# Altium project KitHocTapArduino_V2.PrjPcb
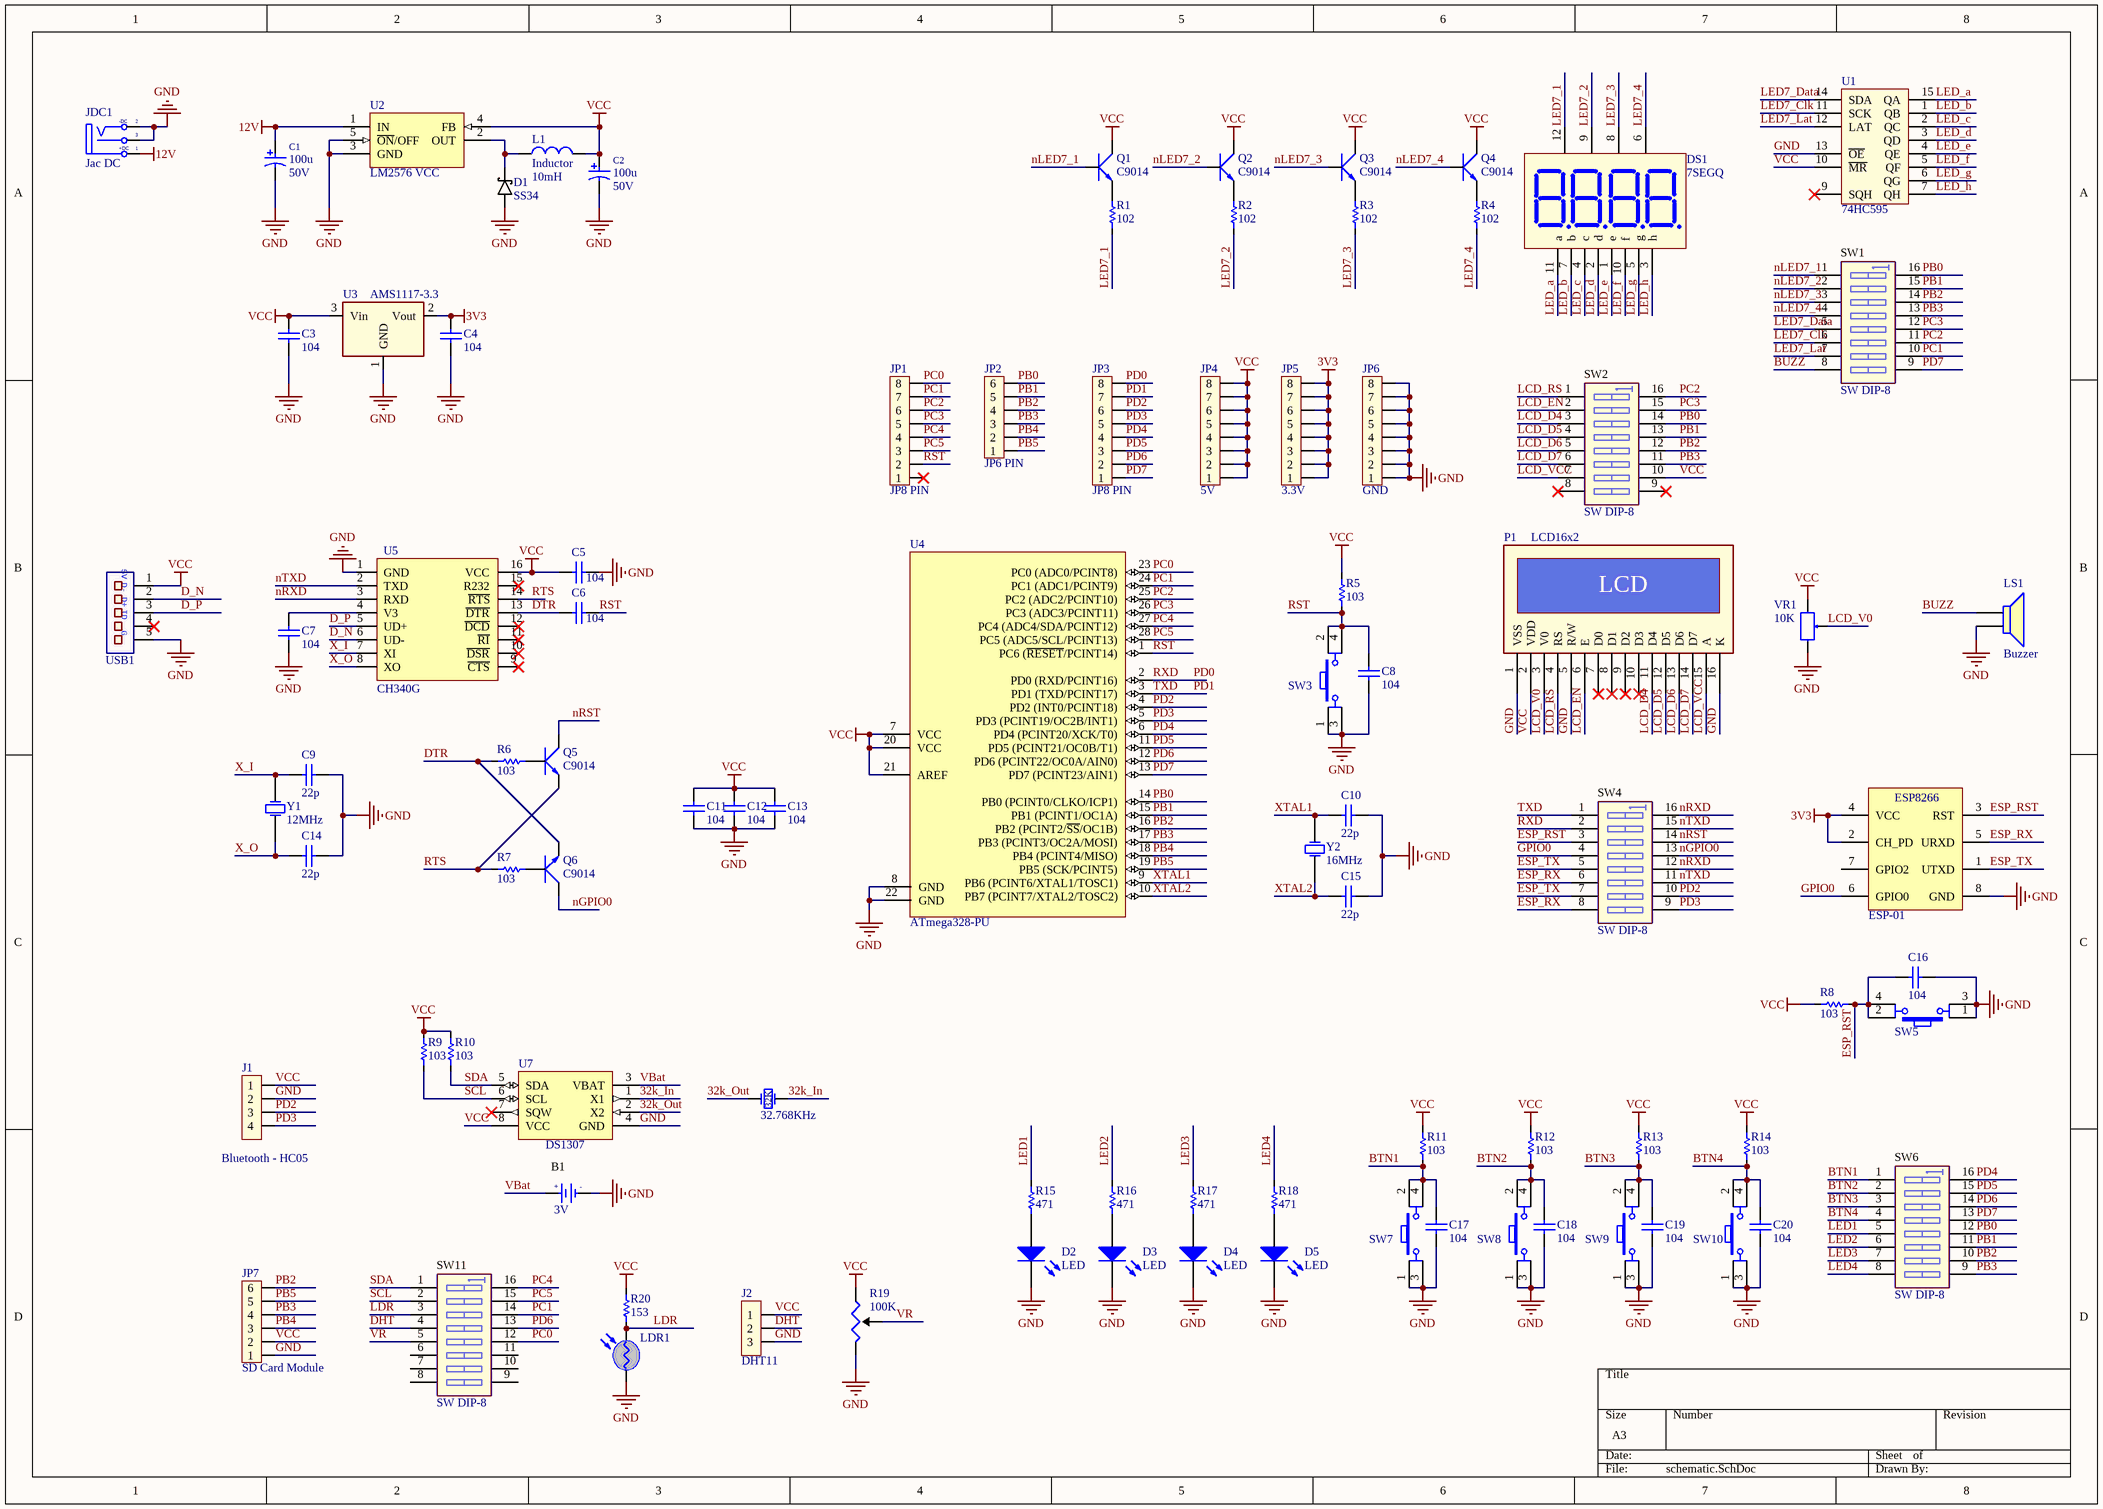
[diagram p0: schematic.SchDoc]
1 sheet, 90 parts. Net scope: global (net labels, ports and power ports of the same name join across sheets).
Board file: PCB3.PcbDoc

## Sheet schematic.SchDoc
size A3

### Parts
B1  value 3V  [CR1220]  (hidden comment: BATT-Holder)
C1  Volt: 50V  [CAP_SMD_6_3MM_N]  (hidden comment: 100u)
C2  Volt: 50V  [CAP_SMD_6_3MM_N]  (hidden comment: 100u)
C3  value 104  [CAP_SMD_0805]  (hidden comment: Cap Non-pol)
C4  value 104  [CAP_SMD_0805]  (hidden comment: Cap Non-pol)
C5  value 104  [CAP_SMD_0805]  (hidden comment: Cap Non-pol)
C6  value 104  [CAP_SMD_0805]  (hidden comment: Cap Non-pol)
C7  value 104  [CAP_SMD_0805]  (hidden comment: Cap Non-pol)
C8  value 104  [CAP_SMD_0805]  (hidden comment: Cap Non-pol)
C9  value 22p  [CAP_SMD_0805]  (hidden comment: Cap Non-pol)
C10  value 22p  [CAP_SMD_0805]  (hidden comment: Cap Non-pol)
C11  value 104  [CAP_SMD_0805]  (hidden comment: Cap Non-pol)
C12  value 104  [CAP_SMD_0805]  (hidden comment: Cap Non-pol)
C13  value 104  [CAP_SMD_0805]  (hidden comment: Cap Non-pol)
C14  value 22p  [CAP_SMD_0805]  (hidden comment: Cap Non-pol)
C15  value 22p  [CAP_SMD_0805]  (hidden comment: Cap Non-pol)
C16  value 104  [CAP_SMD_0805]  (hidden comment: Cap Non-pol)
C17  value 104  [CAP_SMD_0805]  (hidden comment: Cap Non-pol)
C18  value 104  [CAP_SMD_0805]  (hidden comment: Cap Non-pol)
C19  value 104  [CAP_SMD_0805]  (hidden comment: Cap Non-pol)
C20  value 104  [CAP_SMD_0805]  (hidden comment: Cap Non-pol)
D1  SS34  [DO-214AC,SMA]
D2  LED  [LED-0 5mm RED]
D3  LED  [LED-0 5mm RED]
D4  LED  [LED-0 5mm RED]
D5  LED  [LED-0 5mm RED]
DS1  7SEGQ  [LED7SEG-4-0.36]
J1  Bluetooth - HC05  [JP4-D1C]
J2  DHT11  [JP3]
JDC1  Jac DC  [DC-IN]
JP1  JP8 PIN  [JP8]
JP2  JP6 PIN  [JP6]
JP3  JP8 PIN  [JP8]
JP4  5V  [JP8]
JP5  3.3V  [JP8]
JP6  GND  [JP8]
JP7  SD Card Module  [JP6H]
L1  Inductor  value 10mH  [CDRH104]
LDR1  LDR  [CDS]  (value not drawn)
LS1  Buzzer  [Buzzer]
P1  LCD16x2  [LCD16x2]
Q1  C9014  [SOT23C]
Q2  C9014  [SOT23C]
Q3  C9014  [SOT23C]
Q4  C9014  [SOT23C]
Q5  C9014  [SOT23C]
Q6  C9014  [SOT23C]
R1  value 102  [RES_SMD_0805]  (hidden comment: RESISTOR)
R2  value 102  [RES_SMD_0805]  (hidden comment: RESISTOR)
R3  value 102  [RES_SMD_0805]  (hidden comment: RESISTOR)
R4  value 102  [RES_SMD_0805]  (hidden comment: RESISTOR)
R5  value 103  [RES_SMD_0805]  (hidden comment: RESISTOR)
R6  value 103  [RES_SMD_0805]  (hidden comment: RESISTOR)
R7  value 103  [RES_SMD_0805]  (hidden comment: RESISTOR)
R8  value 103  [RES_SMD_0805]  (hidden comment: RESISTOR)
R9  value 103  [RES_SMD_0805]  (hidden comment: RESISTOR)
R10  value 103  [RES_SMD_0805]  (hidden comment: RESISTOR)
R11  value 103  [RES_SMD_0805]  (hidden comment: RESISTOR)
R12  value 103  [RES_SMD_0805]  (hidden comment: RESISTOR)
R13  value 103  [RES_SMD_0805]  (hidden comment: RESISTOR)
R14  value 103  [RES_SMD_0805]  (hidden comment: RESISTOR)
R15  value 471  [RES_SMD_0805]  (hidden comment: RESISTOR)
R16  value 471  [RES_SMD_0805]  (hidden comment: RESISTOR)
R17  value 471  [RES_SMD_0805]  (hidden comment: RESISTOR)
R18  value 471  [RES_SMD_0805]  (hidden comment: RESISTOR)
R19  value 100K  [POT - 24mm]  (hidden comment: Trimmer)
R20  value 153  [RES_SMD_0805]  (hidden comment: RESISTOR)
SW1  SW DIP-8  [DIPSW8]
SW2  SW DIP-8  [DIPSW8]
SW3  SW  [SW4]  (value not drawn)
SW4  SW DIP-8  [DIPSW8]
SW5  SW  [SW4]  (value not drawn)
SW6  SW DIP-8  [DIPSW8]
SW7  SW  [SW4]  (value not drawn)
SW8  SW  [SW4]  (value not drawn)
SW9  SW  [SW4]  (value not drawn)
SW10  SW  [SW4]  (value not drawn)
SW11  SW DIP-8  [DIPSW8]
U1  74HC595  [SO-16]
U2  LM2576 VCC  [LM2576_SMD]
U3  AMS1117-3.3  [SOT223]
U4  ATmega328-PU  [DIP28/W0.3]
U5  CH340G  [SO-16]  (value not drawn)
U6  ESP-01  [ESP8266]
U7  DS1307  [SOP8]
USB1  USB-5  [USB-M3]  (value not drawn)
VR1  10K  [VR]
Y1  12MHz  [XTAL]
Y2  16MHz  [XTAL]
Y3  32.768KHz  [XT32k]

### Nets
3V3: C4.2 JP5.1 JP5.2 JP5.3 JP5.4 JP5.5 JP5.6 JP5.7 JP5.8 U3.2(Vout) U6.2(CH_PD) U6.4(VCC)
12V: C1.1 JDC1.1(T) U2.1(IN)
GND: B1.2(-) C1.2 C2.2 C3.1 C4.1 C5.1 C7.1 C8.1 C9.2 C10.2 C11.1 C12.1 C13.1 C14.2 C15.2 C16.1 C17.1 C18.1 C19.1 C20.1 D1.1(A) D2.2(K) D3.2(K) D4.2(K) D5.2(K) J1.2 J2.3 JDC1.2(TN) JDC1.3(S) JP6.1 JP6.2 JP6.3 JP6.4 JP6.5 JP6.6 JP6.7 JP6.8 JP7.1 LDR1.1(A) LS1.2 P1.1(VSS) P1.5(R/W) P1.16(K) R19.1 SW3.1 SW3.3 SW5.1 SW5.3 SW7.1 SW7.3 SW8.1 SW8.3 SW9.1 SW9.3 SW10.1 SW10.3 U1.8(GND) U1.13(~{OE}) U2.3(GND) U2.5(~{ON}/OFF) U3.1(GND) U4.8(GND) U4.22(GND) U5.1(GND) U6.8(GND) U7.4(GND) USB1.5(P5) VR1.3 Y3.0
VCC: C2.1 C3.2 C5.2 C11.2 C12.2 C13.2 J1.1 J2.1 JP4.1 JP4.2 JP4.3 JP4.4 JP4.5 JP4.6 JP4.7 JP4.8 JP7.2 L1.2 P1.2(VDD) Q1.3(C) Q2.3(C) Q3.3(C) Q4.3(C) R5.2 R8.2 R9.2 R10.2 R11.2 R12.2 R13.2 R14.2 R19.3 R20.2 SW2.10(B7) U1.10(~{MR}) U1.16(VCC) U2.4(FB) U3.3(Vin) U4.7(VCC) U4.20(VCC) U4.21(AREF) U5.16(VCC) U7.8(VCC) USB1.1(P1) VR1.1
32k_In: U7.1(X1) Y3.2(OSC2)
32k_Out: U7.2(X2) Y3.1(OSC1)
BTN1: C17.2 R11.1 SW6.1(A1) SW7.2 SW7.4
BTN2: C18.2 R12.1 SW6.2(A2) SW8.2 SW8.4
BTN3: C19.2 R13.1 SW6.3(A3) SW9.2 SW9.4
BTN4: C20.2 R14.1 SW6.4(A4) SW10.2 SW10.4
BUZZ: LS1.1 SW1.8(A8)
D_N: U5.6(UD-) USB1.2(P2)
D_P: U5.5(UD+) USB1.3(P3)
DHT: J2.2 SW11.4(A4)
DTR: C6.1 Q6.1(E) R6.2 U5.13(~{DTR})
ESP_RST: C16.2 R8.1 SW4.3(A3) SW5.2 SW5.4 U6.3(RST)
ESP_RX: SW4.6(A6) SW4.8(A8) U6.5(URXD)
ESP_TX: SW4.5(A5) SW4.7(A7) U6.1(UTXD)
GPIO0: SW4.4(A4) U6.6(GPIO0)
LCD_D4: P1.11(D4) SW2.3(A3)
LCD_D5: P1.12(D5) SW2.4(A4)
LCD_D6: P1.13(D6) SW2.5(A5)
LCD_D7: P1.14(D7) SW2.6(A6)
LCD_EN: P1.6(E) SW2.2(A2)
LCD_RS: P1.4(RS) SW2.1(A1)
LCD_V0: P1.3(V0) VR1.2
LCD_VCC: P1.15(A) SW2.7(A7)
LDR: LDR1.2(K) R20.1 SW11.3(A3)
LED1: R15.2 SW6.5(A5)
LED2: R16.2 SW6.6(A6)
LED3: R17.2 SW6.7(A7)
LED4: R18.2 SW6.8(A8)
LED7_1: DS1.12(V1) R1.1
LED7_2: DS1.9(V2) R2.1
LED7_3: DS1.8(V3) R3.1
LED7_4: DS1.6(V4) R4.1
LED7_Clk: SW1.6(A6) U1.11(SCK)
LED7_Data: SW1.5(A5) U1.14(SDA)
LED7_Lat: SW1.7(A7) U1.12(LAT)
LED_a: DS1.11(a) U1.15(QA)
LED_b: DS1.7(b) U1.1(QB)
LED_c: DS1.4(c) U1.2(QC)
LED_d: DS1.2(d) U1.3(QD)
LED_e: DS1.1(e) U1.4(QE)
LED_f: DS1.10(f) U1.5(QF)
LED_g: DS1.5(g) U1.6(QG)
LED_h: DS1.3(h) U1.7(QH)
nGPIO0: Q6.3(C) SW4.13(B4)
nLED7_1: Q1.2(B) SW1.1(A1)
nLED7_2: Q2.2(B) SW1.2(A2)
nLED7_3: Q3.2(B) SW1.3(A3)
nLED7_4: Q4.2(B) SW1.4(A4)
nRST: Q5.3(C) SW4.14(B3)
nRXD: SW4.12(B5) SW4.16(B1) U5.3(RXD)
nTXD: SW4.11(B6) SW4.15(B2) U5.2(TXD)
PB0: JP2.6 SW1.16(B1) SW2.14(B3) SW6.12(B5) U4.14(PB0_(PCINT0/CLKO/ICP1))
PB1: JP2.5 SW1.15(B2) SW2.13(B4) SW6.11(B6) U4.15(PB1_(PCINT1/OC1A))
PB2: JP2.4 JP7.6 SW1.14(B3) SW2.12(B5) SW6.10(B7) U4.16(PB2_(PCINT2/~{SS}/OC1B))
PB3: JP2.3 JP7.4 SW1.13(B4) SW2.11(B6) SW6.9(B8) U4.17(PB3_(PCINT3/OC2A/MOSI))
PB4: JP2.2 JP7.3 U4.18(PB4_(PCINT4/MISO))
PB5: JP2.1 JP7.5 U4.19(PB5_(SCK/PCINT5))
PC0: JP1.8 SW11.12(B5) U4.23(PC0_(ADC0/PCINT8))
PC1: JP1.7 SW1.10(B7) SW11.14(B3) U4.24(PC1_(ADC1/PCINT9))
PC2: JP1.6 SW1.11(B6) SW2.16(B1) U4.25(PC2_(ADC2/PCINT10))
PC3: JP1.5 SW1.12(B5) SW2.15(B2) U4.26(PC3_(ADC3/PCINT11))
PC4: JP1.4 SW11.16(B1) U4.27(PC4_(ADC4/SDA/PCINT12))
PC5: JP1.3 SW11.15(B2) U4.28(PC5_(ADC5/SCL/PCINT13))
PD0: JP3.8 SW4.2(A2) U4.2(PD0_(RXD/PCINT16))  [also labelled RXD]
PD1: JP3.7 SW4.1(A1) U4.3(PD1_(TXD/PCINT17))  [also labelled TXD]
PD2: J1.3 JP3.6 SW4.10(B7) U4.4(PD2_(INT0/PCINT18))
PD3: J1.4 JP3.5 SW4.9(B8) U4.5(PD3_(PCINT19/OC2B/INT1))
PD4: JP3.4 SW6.16(B1) U4.6(PD4_(PCINT20/XCK/T0))
PD5: JP3.3 SW6.15(B2) U4.11(PD5_(PCINT21/OC0B/T1))
PD6: JP3.2 SW6.14(B3) SW11.13(B4) U4.12(PD6_(PCINT22/OC0A/AIN0))
PD7: JP3.1 SW1.9(B8) SW6.13(B4) U4.13(PD7_(PCINT23/AIN1))
RST: C6.2 C8.2 JP1.2 R5.1 SW3.2 SW3.4 U4.1(PC6_(~{RESET}/PCINT14))
RTS: Q5.1(E) R7.2 U5.14(~{RTS})
SCL: R9.1 SW11.2(A2) U7.6(SCL)
SDA: R10.1 SW11.1(A1) U7.5(SDA)
VBat: B1.1(+) U7.3(VBAT)
VR: R19.2 SW11.5(A5)
X_I: C9.1 U5.7(XI) Y1.2(OSC2)
X_O: C14.1 U5.8(XO) Y1.1(OSC1)
XTAL1: C10.1 U4.9(PB6_(PCINT6/XTAL1/TOSC1)) Y2.2(OSC2)
XTAL2: C15.1 U4.10(PB7_(PCINT7/XTAL2/TOSC2)) Y2.1(OSC1)
NetC7_2: C7.2 U5.4(V3)
NetD1_2: D1.2(K) L1.1 U2.2(OUT)
NetD2_1: D2.1(A) R15.1
NetD3_1: D3.1(A) R16.1
NetD4_1: D4.1(A) R17.1
NetD5_1: D5.1(A) R18.1
NetQ1_1: Q1.1(E) R1.2
NetQ2_1: Q2.1(E) R2.2
NetQ3_1: Q3.1(E) R3.2
NetQ4_1: Q4.1(E) R4.2
NetQ5_2: Q5.2(B) R6.1
NetQ6_2: Q6.2(B) R7.1

Not connected (* = marked no-connect by the designer): JP1 1*; P1 7(D0)* 8(D1)* 9(D2)* 10(D3)*; SW2 8(A8)* 9(B8)*; SW11 6(A6) 7(A7) 8(A8) 9(B8) 10(B7) 11(B6); U1 9(SQH)*; U5 9(~{CTS})* 10(~{DSR})* 11(~{RI})* 12(~{DCD})* 15(R232)*; U6 7(GPIO2); U7 7(SQW)*; USB1 4(P4)*

### Notes on the sheet
- (in symbol DCIN) -DC; +DC
- (in symbol ESP8266-01) ESP8266
- (in symbol LCD Text) LCD
- (in symbol USB-5) 5V; D-; D+; ID; G
- (in symbol XTAL/32KHz) 32K

### Library data of the parts
B1 = BATT-Holder: Battery holder; Designed By: John MacTavish; Vendor: Digikey; ComponentLink1Description: Digikey Part Link; ComponentLink2Description: Open Datasheet
C1 C2 = Cap_Pol: Polarized Capacitor; Manufacturer: FARNELL; AEMS Code: 2100110; Vendor: Digikey; Capacitor Type: Tant; Published: 13-April-2009; Publisher: Hoang Nguyen; ComponentLink1Description: Digikey Part Link; ComponentLink2Description: Open Datasheet; ComponentLink2URL: H:\LIBRARY\LIBRARY.Datasheet\; Value: 100u
C3-C20 = Cap Non-pol: Non-polarized Capacitor; LatestRevisionNote: Re-released for DXP Platform.; PackageReference: RAD-0.3; Publisher: Altium Limited
D1 = DIODE S
D2-D5 = LED: Typical LED; Published: 8-Jun-2000; LatestRevisionDate: 08-Jul-2005; LatestRevisionNote: Mech Layer 1 removed.; PackageReference: LED-1; Publisher: Altium Limited
DS1 = LED7SEG-4: Four 7 Seg Dipslay; Value: LED 7Q SEG
J1 = JP4
J2 = JP3: Jumper 3; Value: J3
JDC1 = DCIN: Jac DC input; Value: Jac DC
JP1 JP3 = JP8: Value: JP7
JP2 = JP6: Value: JP7
JP4-JP6 = JP8: JP8 PIN; Value: JP7
JP7 = JP6: JP6 PIN; Value: JP7
L1 = Inductor: Code_IEC: 1005; Published: 8-Jun-2000; LatestRevisionDate: 17-Jul-2002; LatestRevisionNote: Re-released for DXP Platform.; PackageReference: 0402-A; Publisher: Altium Limited; Code_JEITA: 0402
LDR1 = LDR: Quang Tro
LS1 = Buzzer: Magnetic Transducer Buzzer; Designed By: John MacTavish; LatestRevisionNote: Schematic revised, PCB Footprint replaced.; PackageReference: ABSM-1574; ComponentLink1Description: Manufacturer Link; ComponentLink1URL: http://www.megastar.com/linecard/buzzmode/index.php
P1 = LCD Text
Q1-Q6 = C9014: NPN 600mW, EBC; Value: C9014
R19 = Variable Resistor: Vendor: Digikey; Published: 8-Jun-2000; LatestRevisionDate: 04-Mar-2005; LatestRevisionNote: PCB Footprint replaced.; PackageReference: J1-0603; Publisher: Altium Limited; ComponentLink1Description: Digikey Part Link; ComponentLink2Description: Open Datasheet; ComponentLink2URL: H:\LIBRARY\LIBRARY.Datasheet\
SW1 SW2 SW4 SW6 SW11 = SW DIP-8: DIP Switch, 8 Position, SPST; Vendor: Digikey; Published: 24-Mar-1999; LatestRevisionDate: 17-Jul-2002; LatestRevisionNote: Re-released for DXP Platform.; PackageReference: DIP_SW_8WAY_SMD; Publisher: Altium Limited; ComponentLink1Description: Digikey Part Link; ComponentLink2Description: Open Datasheet; ComponentLink2URL: H:\LIBRARY\LIBRARY.Datasheet\
SW3 SW5 SW7-SW10 = SW4: Switch button 4 pin; Value: Button chip 4 pin
U1 = 74595: 8 Bit Serial input - Parallel Output; Designed By: John MacTavish; Value: 74HC595
U2 = LM2576: Simple Switcher 3A Step Down Voltage Regulator; Note: Tab is connected to GND; Published: 15-Apr-2002; DatasheetVersion: May-1999; PackageVersion: 2000; PackageReference: T05A; Publisher: Altium Limited; PackageDescription: TO, Thru-Hole, Vertical, Heatsink Mounted; 5 In-Line Leads; Pitch 1.70 mm; Code_JEDEC: TS-001-AA; ComponentLink1Description: Manufacturer Link; ComponentLink1URL: http://www.national.com/; ComponentLink2Description: Datasheet; ComponentLink2URL: H:\LIBRARY\LIBRARY.Datasheet\LM2576.pdf; ComponentLink3Description: URL Link1; ComponentLink3URL: http://www.national.com/pf/LM/LM2575HV.html; Price: 15000 VND
U3 = AMS1117: Regulator SMD Chip; Designed By: John MacTavish; Vendor: Digikey; ComponentLink1Description: Digikey Part Link; ComponentLink2Description: Open Datasheet; ComponentLink2URL: H:\LIBRARY\LIBRARY.Datasheet\
U4 = ATmega328-PU: 8-bit AVR Microcontroller, 32KB Flash, 1KB EEPROM, 2KB SRAM, 28-pin DIP, Industrial Grade (-40°C to 85°C)
U6 = ESP8266-01: ESP-12 Wi-Fi Module
U7 = DS1307: Realtime Clock IC; Manufacturer: Maxim; ComponentLink1Description: Digikey Part Link; ComponentLink2Description: Open Datasheet; ComponentLink2URL: H:\LIBRARY\LIBRARY.Datasheet\DS1307.pdf
USB1 = USB-5: CONN MINI USB RCPT RA TYPE B SMD
VR1 = VR: Var Resistor; Value: VR 10K
Y1 Y2 = XTAL: Crystal Oscillator; Published: 8-Jun-2000; LatestRevisionDate: 17-Jul-2002; LatestRevisionNote: Re-released for DXP Platform.; PackageReference: R38; Publisher: Altium Limited
Y3 = XTAL/32KHz: Crystal Oscillator; Published: 8-Jun-2000; LatestRevisionDate: 17-Jul-2002; LatestRevisionNote: Re-released for DXP Platform.; PackageReference: R38; Publisher: Altium Limited
R1-R18 R20 = RESISTOR: Published: 8-Jun-2000; LatestRevisionDate: 17-Jul-2002; LatestRevisionNote: Re-released for DXP Platform.; PackageReference: AXIAL-0.3; Publisher: Altium Limited